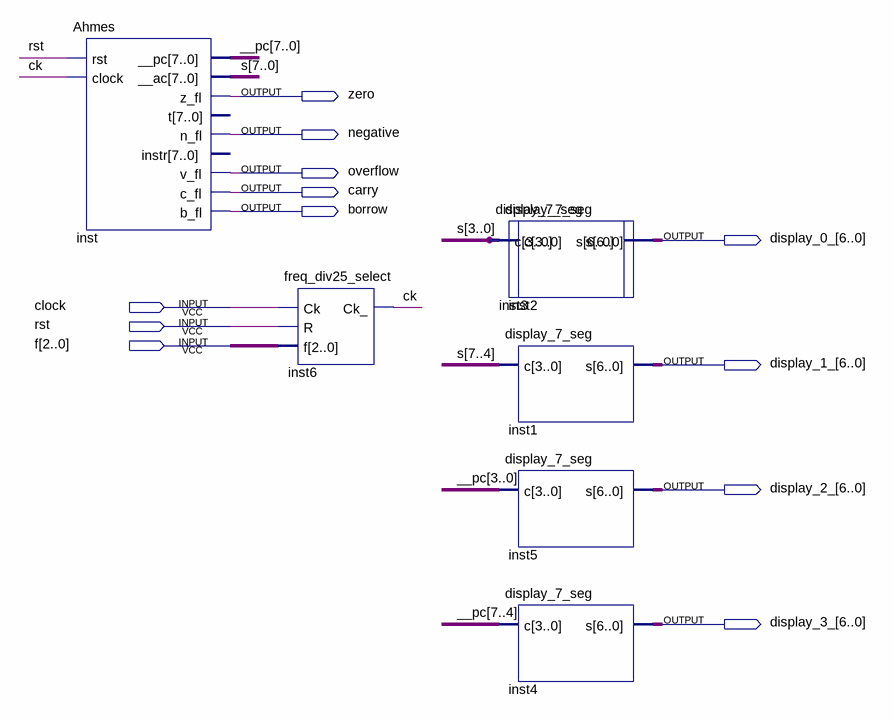
[diagram p0: schematic sheet]
// Quartus schematic Ahmes_board.bdf as structural Verilog: 7 symbols, 12 pins
module Ahmes_board (
  input  clock,
  input  rst,
  input  [2:0] f,
  output zero,
  output negative,
  output overflow,
  output carry,
  output borrow,
  output [6:0] display_0_,
  output [6:0] display_1_,
  output [6:0] display_2_,
  output [6:0] display_3_
);

  wire ck;
  wire [7:0] __pc, s;

  Ahmes inst (
    .rst(rst), .clock(ck), .__pc(__pc), .__ac(s), .z_fl(zero), .n_fl(negative), .v_fl(overflow),
    .c_fl(carry), .b_fl(borrow));  // open: t, instr
  freq_div25_select inst6 (.Ck(clock), .R(rst), .f(f), .Ck_(ck));
  display_7_seg inst2 (.c(s[3:0]), .s(display_0_));
  display_7_seg inst3 (.c(s[3:0]));  // open: s
  display_7_seg inst1 (.c(s[7:4]), .s(display_1_));
  display_7_seg inst5 (.c(__pc[3:0]), .s(display_2_));
  display_7_seg inst4 (.c(__pc[7:4]), .s(display_3_));
endmodule
